# EAGLE schematic mh30 (EAGLE 8.5.1)
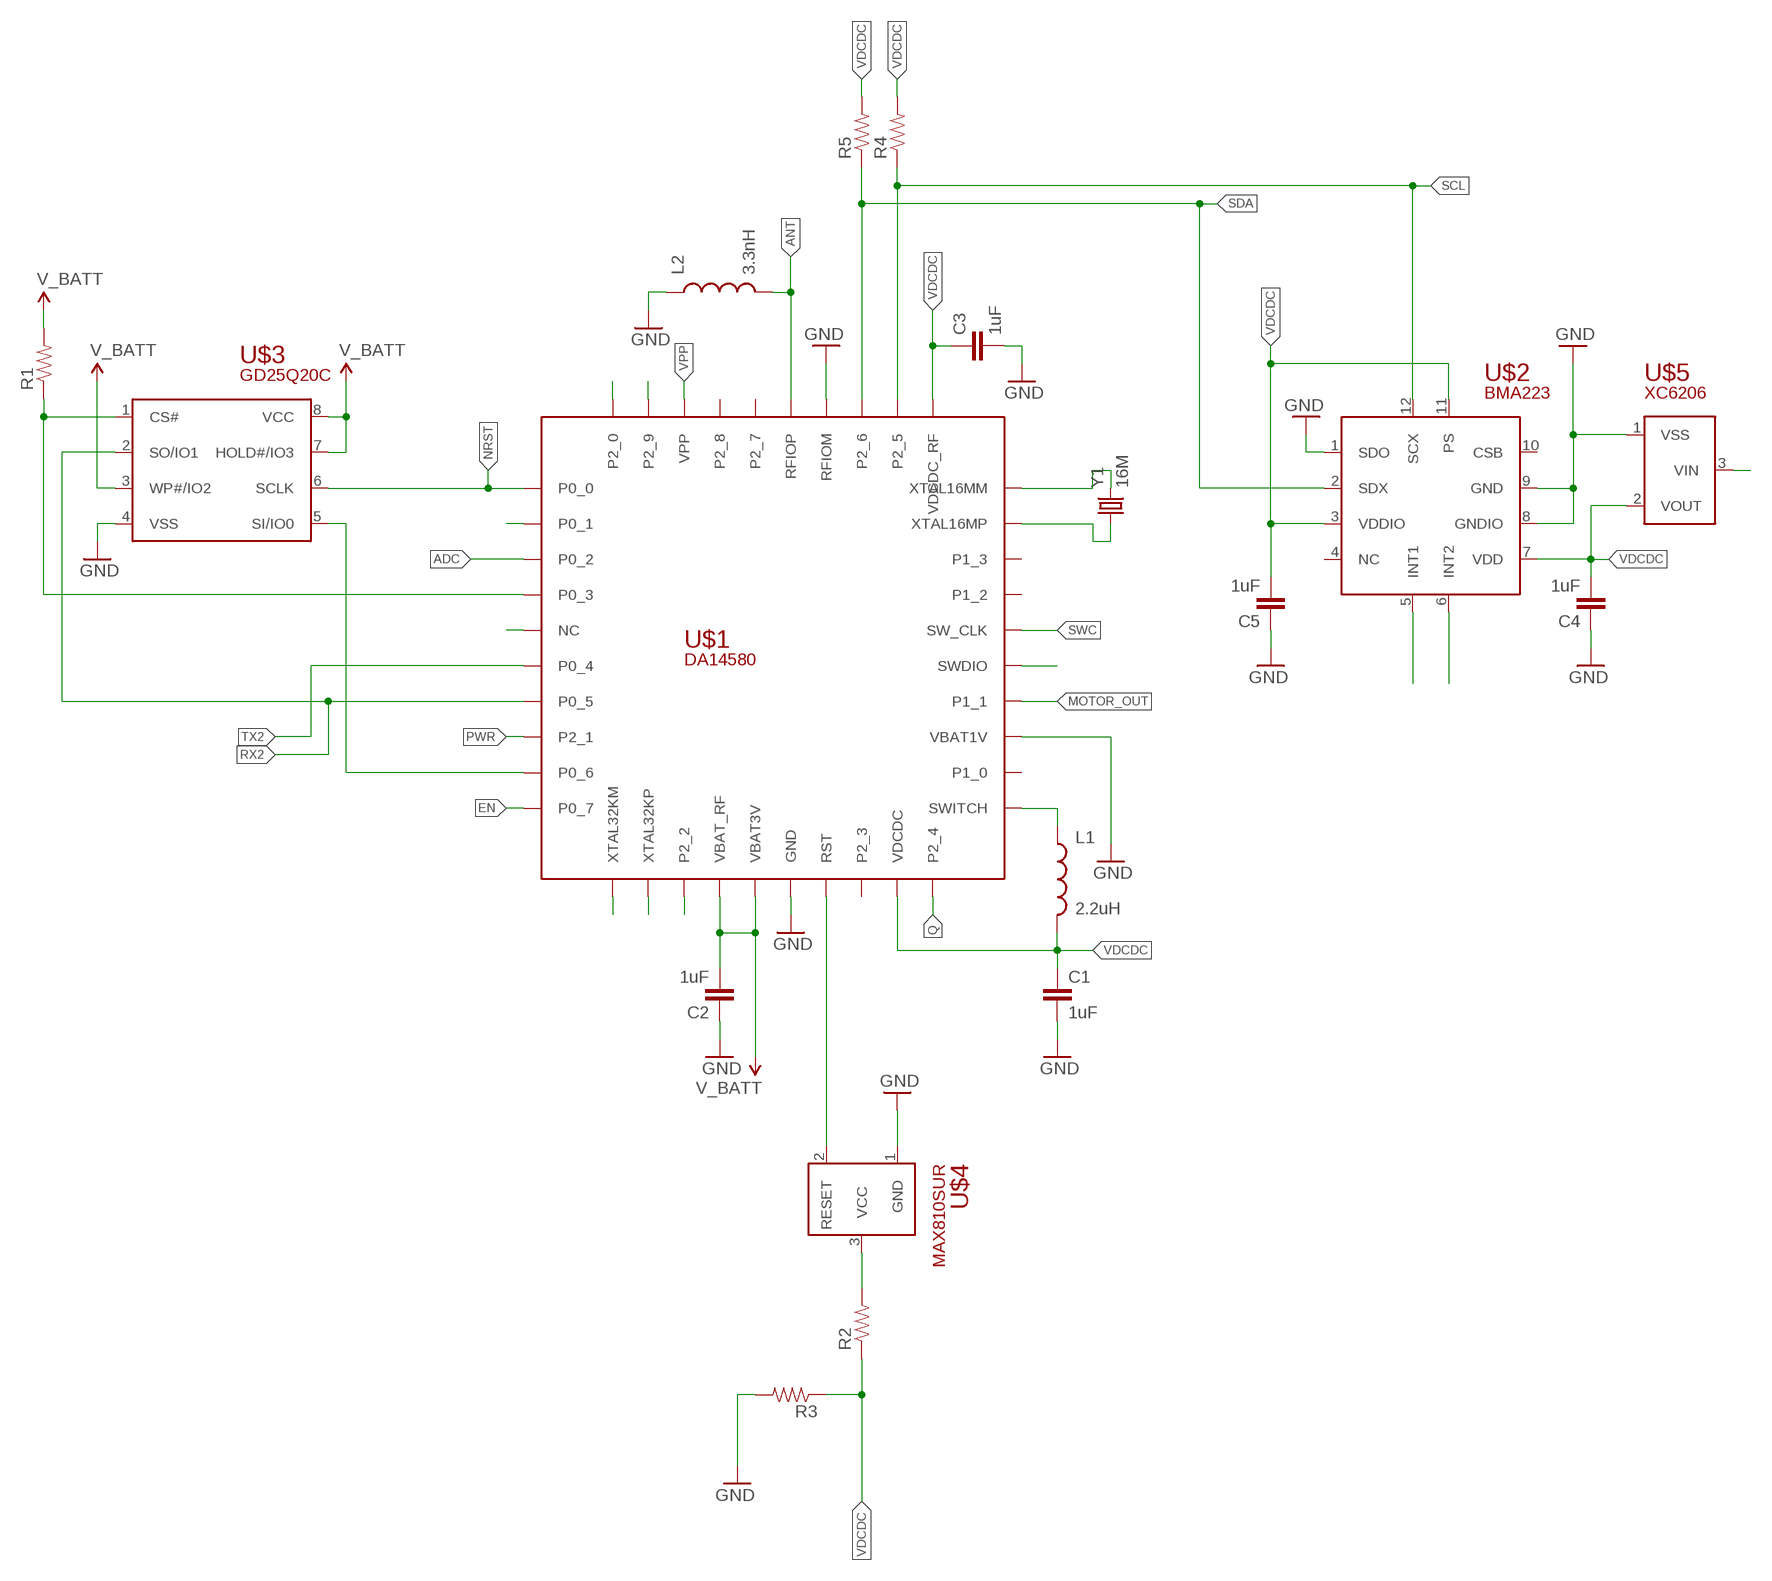
[diagram p0: schematic, sheet 1]

## Parts
C1  1uF  CAP0402-CAP  [0402-CAP]
C2  1uF  CAP0402-CAP  [0402-CAP]
C3  1uF  CAP0402-CAP  [0402-CAP]
C4  1uF  CAP0402-CAP  [0402-CAP]
C5  1uF  CAP0402-CAP  [0402-CAP]
L1  2.2uH  INDUCTOR30OHM,1.8A  [0603]
L2  3.3nH  INDUCTOR30OHM,1.8A  [0603]
R1  RESISTOR0402-RES  [0402-RES]
R2  RESISTOR0402-RES  [0402-RES]
R3  RESISTOR0402-RES  [0402-RES]
R4  RESISTOR0402-RES  [0402-RES]
R5  RESISTOR0402-RES  [0402-RES]
U$1  DA14580  [QFN40]
U$2  BMA223  [LGA12]
U$3  GD25Q20C  [TSSOP8]
U$4  MAX810SUR  [SOT23]
U$5  XC6206  [SOT23]
Y1  16M  CRYSTAL5X3  [CRYSTAL-SMD-5X3]

## Nets
ADC: U$1.3(P0_2)
ANT: L2.2 U$1.35(RFIOP)
EN: U$1.10(P0_7)
GND: C1.2 C2.1 C3.2 C4.1 C5.1 L2.1 R3.2 U$1.16(GND) U$1.23(VBAT1V) U$1.34(RFIOM) U$2.1(SDO) U$2.8(GNDIO) U$2.9(GND) U$3.4(VSS) U$4.1(GND) U$5.1(VSS)
MOTOR_OUT: U$1.24(P1_1)
N$1: U$1.29(XTAL16MP) Y1.1
N$3: U$1.9(P0_6) U$3.5(SI/IO0)
N$4: R1.1 U$1.4(P0_3) U$3.1(CS#)
N$5: U$1.30(XTAL16MM) Y1.3
N$6: U$1.11(XTAL32KM)
N$7: U$1.12(XTAL32KP)
N$8: U$1.5(NC)
N$9: U$1.17(RST)
N$10: R2.2 U$4.3(VCC)
N$11: L1.1 U$1.21(SWITCH)
N$12: U$2.5(INT1)
N$13: U$2.6(INT2)
N$14: U$1.39(P2_9)
N$15: U$1.25(SWDIO)
N$18: U$1.2(P0_1)
N$19: U$1.13(P2_2)
N$20: U$1.40(P2_0)
NRST: U$1.1(P0_0) U$3.6(SCLK)
PWR: U$1.8(P2_1)
Q: U$1.20(P2_4)
RX2: U$1.7(P0_5) U$3.2(SO/IO1)
SCL: R4.1 U$1.32(P2_5) U$2.12(SCX)
SDA: R5.1 U$1.33(P2_6) U$2.2(SDX)
SWC: U$1.26(SW_CLK)
TX2: U$1.6(P0_4)
V_BATT: C2.2 R1.2 U$1.14(VBAT_RF) U$1.15(VBAT3V) U$3.3(WP#/IO2) U$3.7(HOLD#/IO3) U$3.8(VCC)
VDCDC: C1.1 C3.1 C4.2 C5.2 L1.2 R2.1 R3.1 R4.2 R5.2 U$1.19(VDCDC) U$1.31(VDCDC_RF) U$2.3(VDDIO) U$2.7(VDD) U$2.11(PS) U$5.2(VOUT)
VIN: U$5.3(VIN)
VPP: U$1.38(VPP)
Unconnected: U$1.18(P2_3) U$1.22(P1_0) U$1.27(P1_2) U$1.28(P1_3) U$1.36(P2_7) U$1.37(P2_8) U$2.4(NC) U$2.10(CSB) U$4.2(RESET)

## Library data of the parts
C1-C5 = SparkFun-Passives:CAP: Capacitor Standard 0603 ceramic capacitor, and 0.1" leaded capacitor.
L1 L2 = SparkFun-Passives:INDUCTOR: Inductors Basic Inductor/Choke - 0603 and 1206. Footprints are not proven and vary greatly between part numbers. SRN6045- 33uH, 20% 1.4A SDR0403-560KL - 56uH, 10%, 500mA RMS/740mA peak; PROD_ID: RES-07859
R1-R5 = SparkFun-Passives:RESISTOR: Resistor Basic schematic elements and footprints for 0603, 1206, and PTH resistors.
U$1 = mh30:DA14580
U$2 = mh30:BMA223
U$3 = mh30:GD25Q20C
U$4 = mh30:MAX810SUR
U$5 = mh30:XC6206
Y1 = SparkFun-FreqCtrl:CRYSTAL: Various standard crystals. Proven footprints. Spark Fun Electronics SKU : COM-00534